# EAGLE schematic Grownetics 12 Channel CT Shield (EAGLE 7.2.0)
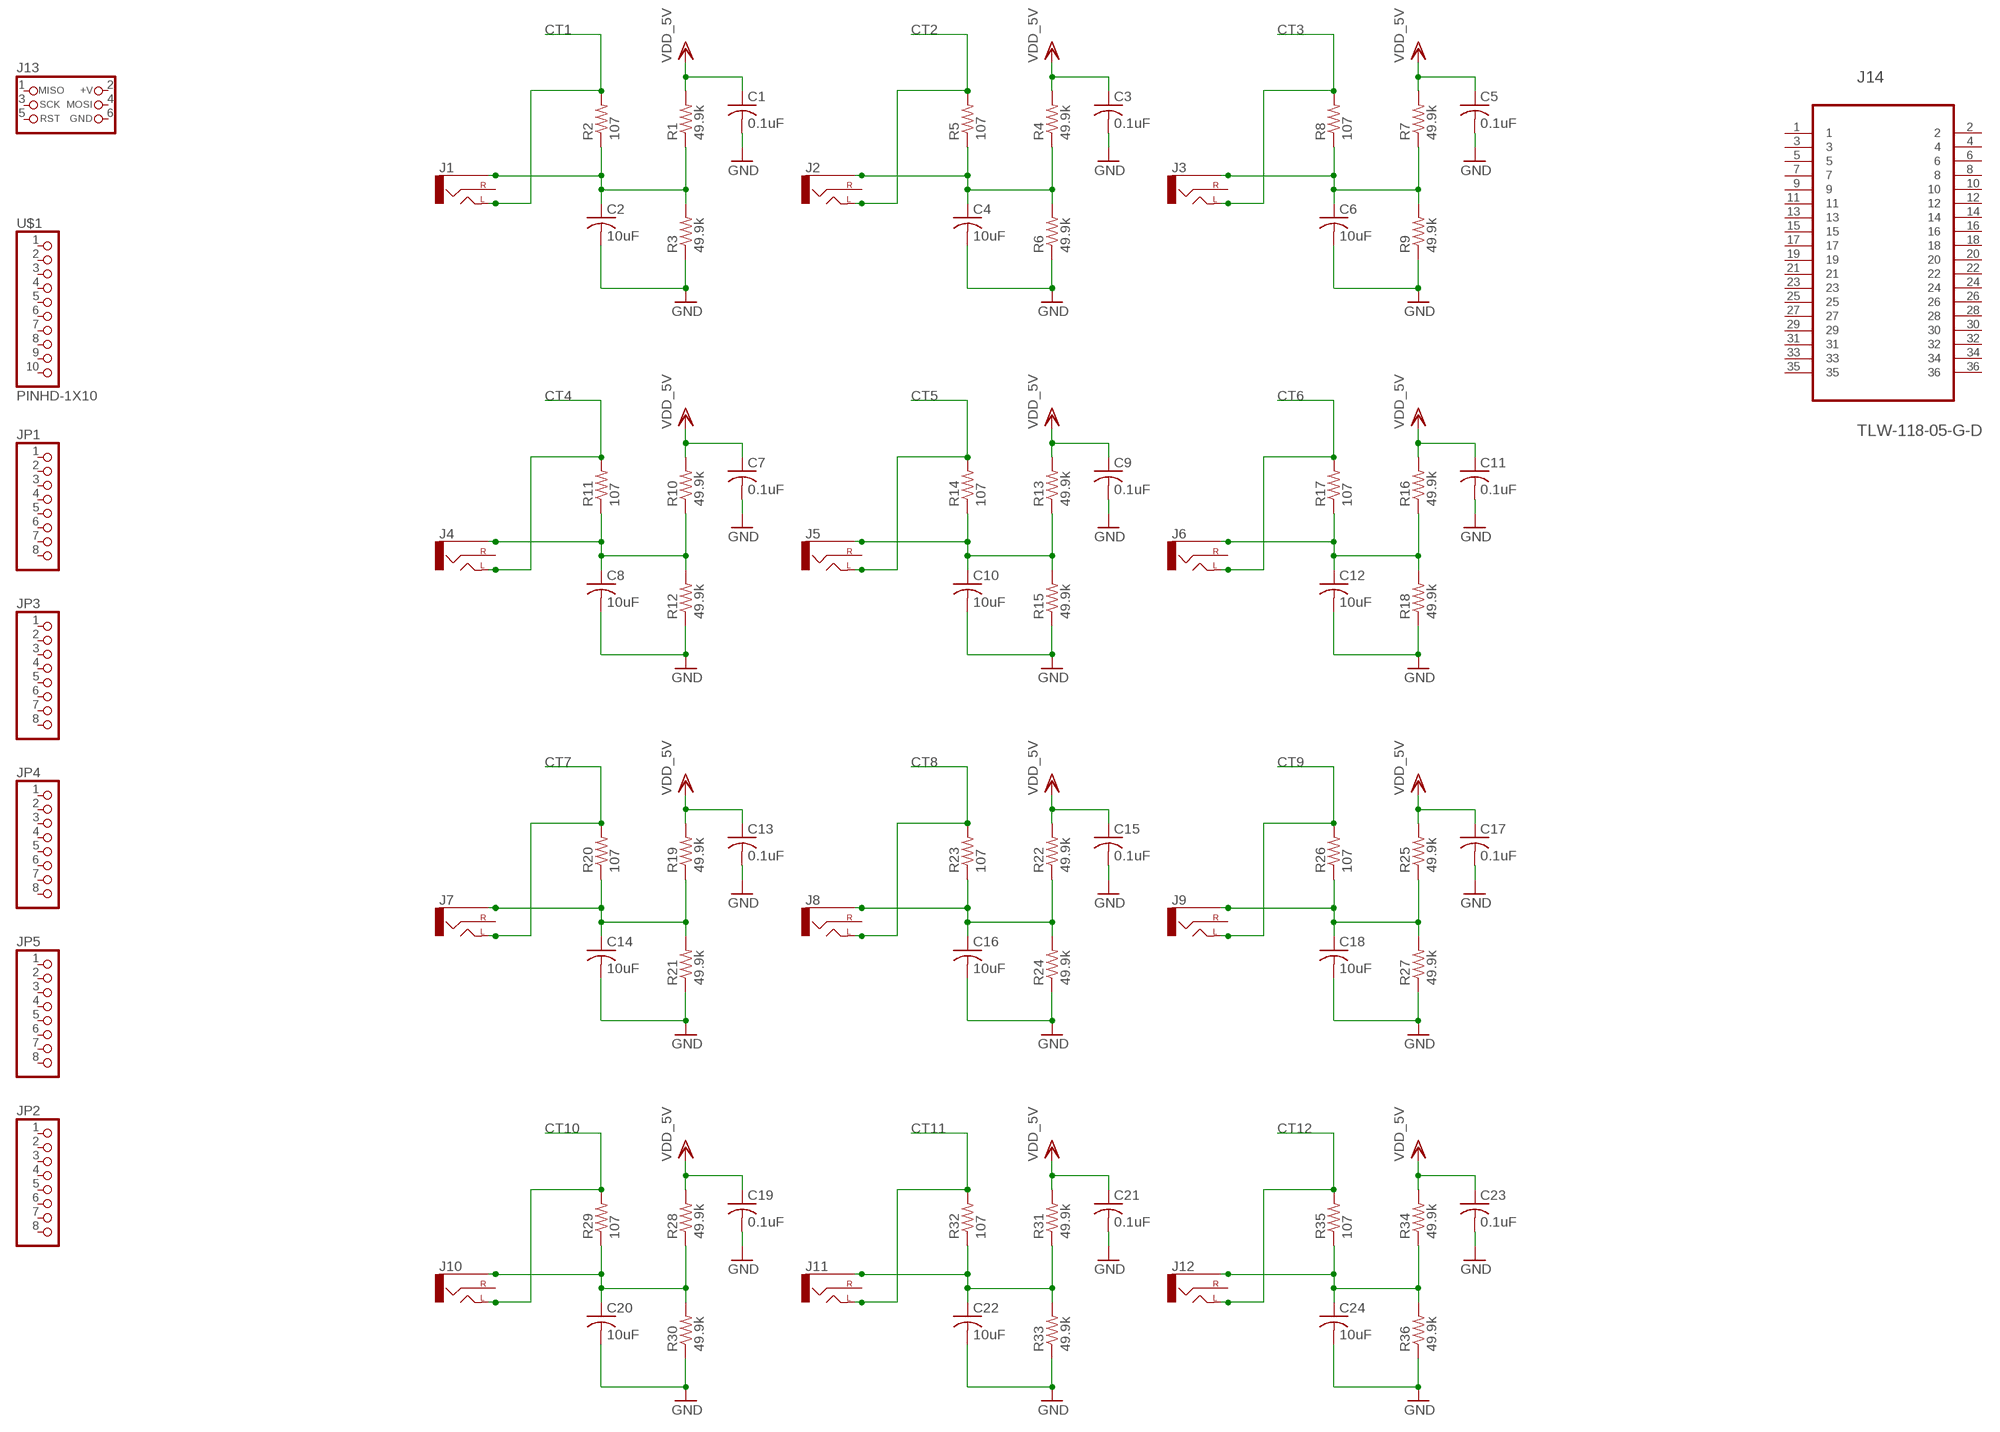
[diagram p0: schematic, sheet 1]

## Parts
C1  0.1uF  C-USC0805  [C0805]
C2  10uF  C-USC0805  [C0805]
C3  0.1uF  C-USC0805  [C0805]
C4  10uF  C-USC0805  [C0805]
C5  0.1uF  C-USC0805  [C0805]
C6  10uF  C-USC0805  [C0805]
C7  0.1uF  C-USC0805  [C0805]
C8  10uF  C-USC0805  [C0805]
C9  0.1uF  C-USC0805  [C0805]
C10  10uF  C-USC0805  [C0805]
C11  0.1uF  C-USC0805  [C0805]
C12  10uF  C-USC0805  [C0805]
C13  0.1uF  C-USC0805  [C0805]
C14  10uF  C-USC0805  [C0805]
C15  0.1uF  C-USC0805  [C0805]
C16  10uF  C-USC0805  [C0805]
C17  0.1uF  C-USC0805  [C0805]
C18  10uF  C-USC0805  [C0805]
C19  0.1uF  C-USC0805  [C0805]
C20  10uF  C-USC0805  [C0805]
C21  0.1uF  C-USC0805  [C0805]
C22  10uF  C-USC0805  [C0805]
C23  0.1uF  C-USC0805  [C0805]
C24  10uF  C-USC0805  [C0805]
J1  AUDIO-JACKSMD2  [AUDIO-JACK-3.5MM-SMD]
J2  AUDIO-JACKSMD2  [AUDIO-JACK-3.5MM-SMD]
J3  AUDIO-JACKSMD2  [AUDIO-JACK-3.5MM-SMD]
J4  AUDIO-JACKSMD2  [AUDIO-JACK-3.5MM-SMD]
J5  AUDIO-JACKSMD2  [AUDIO-JACK-3.5MM-SMD]
J6  AUDIO-JACKSMD2  [AUDIO-JACK-3.5MM-SMD]
J7  AUDIO-JACKSMD2  [AUDIO-JACK-3.5MM-SMD]
J8  AUDIO-JACKSMD2  [AUDIO-JACK-3.5MM-SMD]
J9  AUDIO-JACKSMD2  [AUDIO-JACK-3.5MM-SMD]
J10  AUDIO-JACKSMD2  [AUDIO-JACK-3.5MM-SMD]
J11  AUDIO-JACKSMD2  [AUDIO-JACK-3.5MM-SMD]
J12  AUDIO-JACKSMD2  [AUDIO-JACK-3.5MM-SMD]
J13  CON_HEADER_PRG_AVR_ICSP-PTH  [HEADER_PRG_2X03]
J14  TLW-118-05-G-D  [SAMTEC_TLW-118-05-G-D]
JP1  PINHD-1X8-3.5MM  [1X08-3.5MM]
JP2  PINHD-1X8-3.5MM  [1X08-3.5MM]
JP3  PINHD-1X8-3.5MM  [1X08-3.5MM]
JP4  PINHD-1X8-3.5MM  [1X08-3.5MM]
JP5  PINHD-1X8-3.5MM  [1X08-3.5MM]
R1  49.9k  R-US_M0805  [M0805]
R2  107  R-US_M0805  [M0805]
R3  49.9k  R-US_M0805  [M0805]
R4  49.9k  R-US_M0805  [M0805]
R5  107  R-US_M0805  [M0805]
R6  49.9k  R-US_M0805  [M0805]
R7  49.9k  R-US_M0805  [M0805]
R8  107  R-US_M0805  [M0805]
R9  49.9k  R-US_M0805  [M0805]
R10  49.9k  R-US_M0805  [M0805]
R11  107  R-US_M0805  [M0805]
R12  49.9k  R-US_M0805  [M0805]
R13  49.9k  R-US_M0805  [M0805]
R14  107  R-US_M0805  [M0805]
R15  49.9k  R-US_M0805  [M0805]
R16  49.9k  R-US_M0805  [M0805]
R17  107  R-US_M0805  [M0805]
R18  49.9k  R-US_M0805  [M0805]
R19  49.9k  R-US_M0805  [M0805]
R20  107  R-US_M0805  [M0805]
R21  49.9k  R-US_M0805  [M0805]
R22  49.9k  R-US_M0805  [M0805]
R23  107  R-US_M0805  [M0805]
R24  49.9k  R-US_M0805  [M0805]
R25  49.9k  R-US_M0805  [M0805]
R26  107  R-US_M0805  [M0805]
R27  49.9k  R-US_M0805  [M0805]
R28  49.9k  R-US_M0805  [M0805]
R29  107  R-US_M0805  [M0805]
R30  49.9k  R-US_M0805  [M0805]
R31  49.9k  R-US_M0805  [M0805]
R32  107  R-US_M0805  [M0805]
R33  49.9k  R-US_M0805  [M0805]
R34  49.9k  R-US_M0805  [M0805]
R35  107  R-US_M0805  [M0805]
R36  49.9k  R-US_M0805  [M0805]
U$1  PINHD-1X10  [1X10-BIG]

## Nets
CT1: J1.TIP(LEFT) R2.2
CT2: J2.TIP(LEFT) R5.2
CT3: J3.TIP(LEFT) R8.2
CT4: J4.TIP(LEFT) R11.2
CT5: J5.TIP(LEFT) R14.2
CT6: J6.TIP(LEFT) R17.2
CT7: J7.TIP(LEFT) R20.2
CT8: J8.TIP(LEFT) R23.2
CT9: J9.TIP(LEFT) R26.2
CT10: J10.TIP(LEFT) R29.2
CT11: J11.TIP(LEFT) R32.2
CT12: J12.TIP(LEFT) R35.2
GND: C1.2 C2.2 C3.2 C4.2 C5.2 C6.2 C7.2 C8.2 C9.2 C10.2 C11.2 C12.2 C13.2 C14.2 C15.2 C16.2 C17.2 C18.2 C19.2 C20.2 C21.2 C22.2 C23.2 C24.2 R3.1 R6.1 R9.1 R12.1 R15.1 R18.1 R21.1 R24.1 R27.1 R30.1 R33.1 R36.1
N$1: C4.1 J2.SLEEVE R4.1 R5.1 R6.2
N$2: C2.1 J1.SLEEVE R1.1 R2.1 R3.2
N$3: C6.1 J3.SLEEVE R7.1 R8.1 R9.2
N$4: C8.1 J4.SLEEVE R10.1 R11.1 R12.2
N$5: C10.1 J5.SLEEVE R13.1 R14.1 R15.2
N$6: C12.1 J6.SLEEVE R16.1 R17.1 R18.2
N$7: C14.1 J7.SLEEVE R19.1 R20.1 R21.2
N$8: C16.1 J8.SLEEVE R22.1 R23.1 R24.2
N$9: C18.1 J9.SLEEVE R25.1 R26.1 R27.2
N$10: C20.1 J10.SLEEVE R28.1 R29.1 R30.2
N$11: C22.1 J11.SLEEVE R31.1 R32.1 R33.2
N$12: C24.1 J12.SLEEVE R34.1 R35.1 R36.2
VDD: C1.1 C3.1 C5.1 C7.1 C9.1 C11.1 C13.1 C15.1 C17.1 C19.1 C21.1 C23.1 R1.2 R4.2 R7.2 R10.2 R13.2 R16.2 R19.2 R22.2 R25.2 R28.2 R31.2 R34.2 ; supply symbol labelled VDD_5V
Unconnected: J1.RING(RIGHT) J2.RING(RIGHT) J3.RING(RIGHT) J4.RING(RIGHT) J5.RING(RIGHT) J6.RING(RIGHT) J7.RING(RIGHT) J8.RING(RIGHT) J9.RING(RIGHT) J10.RING(RIGHT) J11.RING(RIGHT) J12.RING(RIGHT) J13.1(MISO) J13.2(+V) J13.3(SCK) J13.4(MOSI) J13.5(RST) J13.6(GND) J14.1 J14.2 J14.3 J14.4 J14.5 J14.6 J14.7 J14.8 J14.9 J14.10 J14.11 J14.12 J14.13 J14.14 J14.15 J14.16 J14.17 J14.18 J14.19 J14.20 J14.21 J14.22 J14.23 J14.24 J14.25 J14.26 J14.27 J14.28 J14.29 J14.30 J14.31 J14.32 J14.33 J14.34 J14.35 J14.36 JP1.1 JP1.2 JP1.3 JP1.4 JP1.5 JP1.6 JP1.7 JP1.8 JP2.1 JP2.2 JP2.3 JP2.4 JP2.5 JP2.6 JP2.7 JP2.8 JP3.1 JP3.2 JP3.3 JP3.4 JP3.5 JP3.6 JP3.7 JP3.8 JP4.1 JP4.2 JP4.3 JP4.4 JP4.5 JP4.6 JP4.7 JP4.8 JP5.1 JP5.2 JP5.3 JP5.4 JP5.5 JP5.6 JP5.7 JP5.8 U$1.1 U$1.2 U$1.3 U$1.4 U$1.5 U$1.6 U$1.7 U$1.8 U$1.9 U$1.10

## Library data of the parts
C1-C24 = resistor:C-US: CAPACITOR, American symbol
J1-J12 = SparkFun-Connectors:AUDIO-JACK: 3.5mm Audio Jack Simple 3.5mm common PCB mount audio jack. Variant PTH is our storefront SKU PRT-08032; PROD_ID: CONN-10353
J13 = dp_devices:CON_HEADER_PRG_AVR_ICSP: 2x3 AVR ICSP programming header
J14 = SAMTEC-Txx_By_element14_Batch_1:TLW-118-05-G-D: LOW PROFILE HEADER, DOUBLE ROW, 36 way; MPN: TLW-118-05-G-D; OC_FARNELL: -; OC_NEWARK: 12P0498; PACKAGE: LOW PROFILE HEADER; SUPPLIER: SAMTEC
JP1-JP5 = adafruit:PINHD-1X8: PIN HEADER
R1-R36 = resistor:R-US_: RESISTOR, American symbol
U$1 = adafruit:PINHD-1X10: Pin header 1x10 0.1" spacing With round pins